# Altium schematic sheet BANK500_501.SchDoc
size A4; SheetNumber: 5; SheetTotal: 13
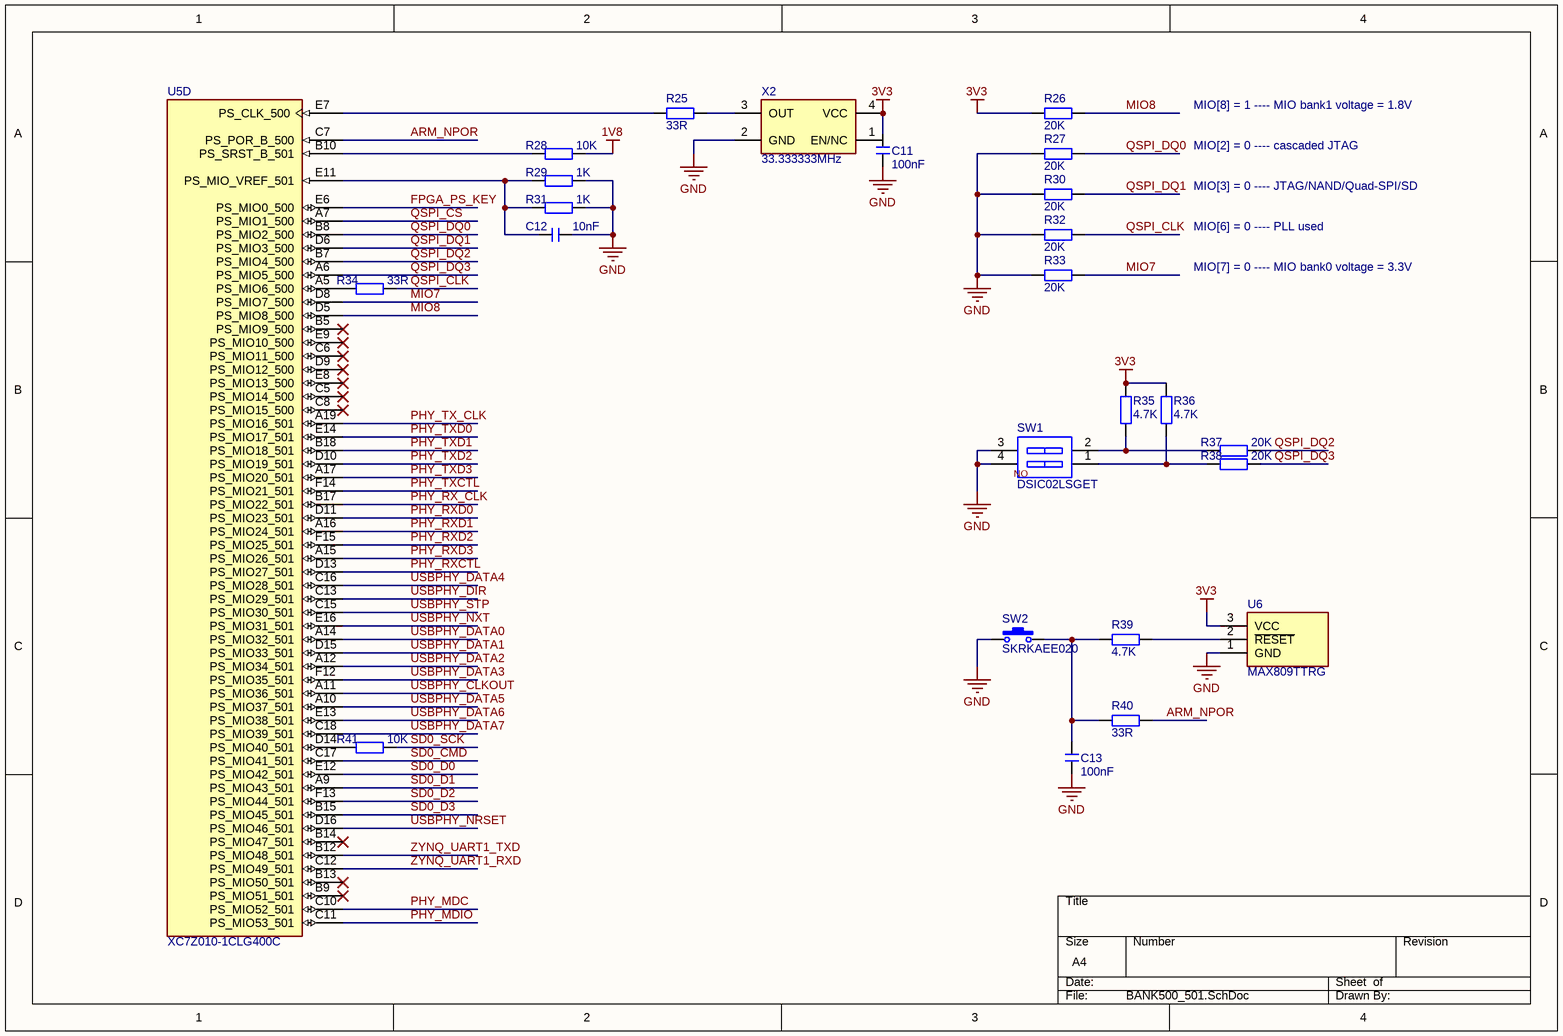
[diagram p0: BANK500_501.SchDoc]

## Parts
C11  100nF  [C 0402_L]
C12  10nF  [C 0402_L]
C13  100nF  [C 0402_L]
R25  33R  [R 0805_L]
R26  20K  [R 0805_L]
R27  20K  [R 0805_L]
R28  10K  [R 0402_L]
R29  1K  [R 0402_L]
R30  20K  [R 0805_L]
R31  1K  [R 0402_L]
R32  20K  [R 0805_L]
R33  20K  [R 0805_L]
R34  33R  [R 0805_L]
R35  4.7K  [R 0402_L]
R36  4.7K  [R 0402_L]
R37  20K  [R 0805_L]
R38  20K  [R 0805_L]
R39  4.7K  [R 0402_L]
R40  33R  [R 0805_L]
R41  10K  [R 0402_L]
SW1  DSIC02LSGET  [SOP254P930X445-4N]
SW2  SKRKAEE020  [SKRKAEE020]
U5  XC7Z010-1CLG400C  [CLG400]  (part D of 9)
U6  MAX809TTRG  [SOT23-3L]
X2  33.333333MHz  [OSC 1612-4P]

## Nets
1V8: R28.1
3V3: C11.2 R26.2 R35.1 R36.1 U6.3(VCC) X2.4(VCC)
GND: C11.1 C12.1 C13.1 R27.2 R29.1 R30.2 R31.1 R32.2 R33.2 SW1.3 SW1.4 SW2.1 U6.1(GND) X2.2(GND)
ARM_NPOR: R40.1 U5.C7(PS_POR_B_500)
FPGA_PS_KEY: U5.E6(PS_MIO0_500)
MIO7: R33.1 U5.D8(PS_MIO7_500)
MIO8: R26.1 U5.D5(PS_MIO8_500)
PHY_MDC: U5.C10(PS_MIO52_501)
PHY_MDIO: U5.C11(PS_MIO53_501)
PHY_RX_CLK: U5.B17(PS_MIO22_501)
PHY_RXCTL: U5.D13(PS_MIO27_501)
PHY_RXD0: U5.D11(PS_MIO23_501)
PHY_RXD1: U5.A16(PS_MIO24_501)
PHY_RXD2: U5.F15(PS_MIO25_501)
PHY_RXD3: U5.A15(PS_MIO26_501)
PHY_TX_CLK: U5.A19(PS_MIO16_501)
PHY_TXCTL: U5.F14(PS_MIO21_501)
PHY_TXD0: U5.E14(PS_MIO17_501)
PHY_TXD1: U5.B18(PS_MIO18_501)
PHY_TXD2: U5.D10(PS_MIO19_501)
PHY_TXD3: U5.A17(PS_MIO20_501)
QSPI_CLK: R32.1 R34.1
QSPI_CS: U5.A7(PS_MIO1_500)
QSPI_DQ0: R27.1 U5.B8(PS_MIO2_500)
QSPI_DQ1: R30.1 U5.D6(PS_MIO3_500)
QSPI_DQ2: R37.1 U5.B7(PS_MIO4_500)
QSPI_DQ3: R38.1 U5.A6(PS_MIO5_500)
SD0_CMD: U5.C17(PS_MIO41_501)
SD0_D0: U5.E12(PS_MIO42_501)
SD0_D1: U5.A9(PS_MIO43_501)
SD0_D2: U5.F13(PS_MIO44_501)
SD0_D3: U5.B15(PS_MIO45_501)
SD0_SCK: R41.1
USBPHY_CLKOUT: U5.A11(PS_MIO36_501)
USBPHY_DATA0: U5.A14(PS_MIO32_501)
USBPHY_DATA1: U5.D15(PS_MIO33_501)
USBPHY_DATA2: U5.A12(PS_MIO34_501)
USBPHY_DATA3: U5.F12(PS_MIO35_501)
USBPHY_DATA4: U5.C16(PS_MIO28_501)
USBPHY_DATA5: U5.A10(PS_MIO37_501)
USBPHY_DATA6: U5.E13(PS_MIO38_501)
USBPHY_DATA7: U5.C18(PS_MIO39_501)
USBPHY_DIR: U5.C13(PS_MIO29_501)
USBPHY_NRSET: U5.D16(PS_MIO46_501)
USBPHY_NXT: U5.E16(PS_MIO31_501)
USBPHY_STP: U5.C15(PS_MIO30_501)
ZYNQ_UART1_RXD: U5.C12(PS_MIO49_501)
ZYNQ_UART1_TXD: U5.B12(PS_MIO48_501)
NetC12_2: C12.2 R29.2 R31.2 U5.E11(PS_MIO_VREF_501)
NetC13_2: C13.2 R39.2 R40.2 SW2.2
NetR25_1: R25.1 X2.3(OUT)
NetR25_2: R25.2 U5.E7(PS_CLK_500)
NetR28_2: R28.2 U5.B10(PS_SRST_B_501)
NetR34_2: R34.2 U5.A5(PS_MIO6_500)
NetR35_2: R35.2 R37.2 SW1.2
NetR36_2: R36.2 R38.2 SW1.1
NetR39_1: R39.1 U6.2(~{RESET})
NetR41_2: R41.2 U5.D14(PS_MIO40_501)

Not connected (* = marked no-connect by the designer): U5 B5(PS_MIO9_500)* B9(PS_MIO51_501)* B13(PS_MIO50_501)* B14(PS_MIO47_501)* C5(PS_MIO14_500)* C6(PS_MIO11_500)* C8(PS_MIO15_500)* D9(PS_MIO12_500)* E8(PS_MIO13_500)* E9(PS_MIO10_500)*; X2 1(EN/NC)

## Notes on the sheet
- MIO[8] = 1 ---- MIO bank1 voltage = 1.8V
- MIO[2] = 0 ---- cascaded JTAG
- MIO[3] = 0 ---- JTAG/NAND/Quad-SPI/SD
- MIO[6] = 0 ---- PLL used
- MIO[7] = 0 ---- MIO bank0 voltage = 3.3V
- (in symbol DSIC02LSGET) ON

## Library data of the parts
C11-C13 = C: 无极性贴片电容; 版权归属: 源创客; BOM名称: 无极性贴片电容; 学习资源: www.ooocke.com
R25-R41 = R: 贴片电阻; 版权归属: 源创客; BOM名称: 贴片电阻; 学习资源: www.ooocke.com
SW1 = DSIC02LSGET: 2路拨动开关; Manufacturer_Name: Dongguan Guangzhu Industrial; Datasheet Link: https://datasheet.lcsc.com/szlcsc/Dongguan-Guangzhu-Industrial-DSIC02LSGET_C54949.pdf; Height: 4.45mm; Manufacturer_Part_Number: DSIC02LSGET
SW2 = SKRKAEE020: 2.9x3.9轻触开关; BOM名称: 3x6轻触开关; 联系卖家，免费查找封装: 唯一出售店铺网址https://shop463601444.taobao.com; 封装库来自淘宝卖家ID：黄晶宝石: 其他店铺购入的，请立即申请退款，本店现金奖励20~500元
U5 = XC7Z010-1CLG400C: ZYNQ7000芯片
U6 = MAX809TTRG: 电压检测复位芯片; Manufacturer_Name: onsemi; Datasheet Link: http://www.onsemi.com/pub/Collateral/MAX809S-D.PDF; Height: 1.11mm; Manufacturer_Part_Number: MAX809TTRG; Mouser Part Number: 863-MAX809TTRG; Mouser Price/Stock: https://www.mouser.com/Search/Refine.aspx?Keyword=863-MAX809TTRG; Arrow Part Number: MAX809TTRG; Arrow Price/Stock: https://www.arrow.com/en/products/max809ttrg/on-semiconductor
X2 = XTAL-ACT-4P: 4脚有源晶振; 版权归属: 源创客; BOM名称: 4脚有源晶振; 学习资源: www.ooocke.com